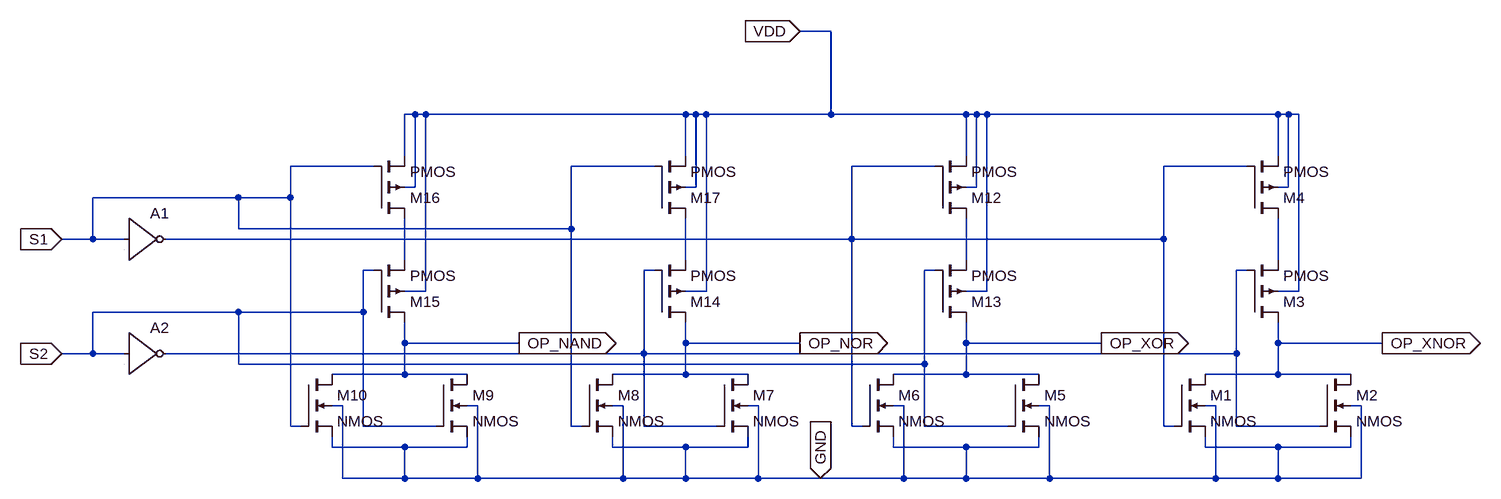
[diagram p0: schematic DEC_2_4.asc]
DEC_2_4.asc, the LTspice schematic file:
Version 4
SHEET 1 880 680
WIRE -416 -320 -464 -320
WIRE -1056 -192 -1072 -192
WIRE -1040 -192 -1056 -192
WIRE -640 -192 -1040 -192
WIRE -624 -192 -640 -192
WIRE -608 -192 -624 -192
WIRE -416 -192 -416 -320
WIRE -416 -192 -608 -192
WIRE -208 -192 -416 -192
WIRE -192 -192 -208 -192
WIRE -176 -192 -192 -192
WIRE 272 -192 -176 -192
WIRE 288 -192 272 -192
WIRE 304 -192 288 -192
WIRE -1072 -128 -1072 -192
WIRE -640 -128 -640 -192
WIRE -208 -128 -208 -192
WIRE 272 -128 272 -192
WIRE -1120 -112 -1248 -112
WIRE -688 -112 -816 -112
WIRE -256 -112 -384 -112
WIRE 224 -112 96 -112
WIRE -1056 -80 -1056 -192
WIRE -1056 -80 -1072 -80
WIRE -624 -80 -624 -192
WIRE -624 -80 -640 -80
WIRE -192 -80 -192 -192
WIRE -192 -80 -208 -80
WIRE 288 -80 288 -192
WIRE 288 -80 272 -80
WIRE -1328 -64 -1552 -64
WIRE -1248 -64 -1248 -112
WIRE -1248 -64 -1328 -64
WIRE -1328 -16 -1328 -64
WIRE -816 -16 -816 -112
WIRE -816 -16 -1328 -16
WIRE -1552 0 -1552 -64
WIRE -1552 0 -1600 0
WIRE -1504 0 -1552 0
WIRE -384 0 -384 -112
WIRE -384 0 -1440 0
WIRE 96 0 96 -112
WIRE 96 0 -384 0
WIRE -1072 32 -1072 -32
WIRE -640 32 -640 -32
WIRE -208 32 -208 -32
WIRE 272 32 272 -32
WIRE -1120 48 -1136 48
WIRE -688 48 -704 48
WIRE -256 48 -272 48
WIRE 224 48 208 48
WIRE -1040 80 -1040 -192
WIRE -1040 80 -1072 80
WIRE -608 80 -608 -192
WIRE -608 80 -640 80
WIRE -176 80 -176 -192
WIRE -176 80 -208 80
WIRE 304 80 304 -192
WIRE 304 80 272 80
WIRE -1328 112 -1552 112
WIRE -1136 112 -1136 48
WIRE -1136 112 -1328 112
WIRE -1072 160 -1072 128
WIRE -896 160 -1072 160
WIRE -640 160 -640 128
WIRE -464 160 -640 160
WIRE -208 160 -208 128
WIRE 0 160 -208 160
WIRE 272 160 272 128
WIRE 432 160 272 160
WIRE -1552 176 -1552 112
WIRE -1552 176 -1600 176
WIRE -1504 176 -1552 176
WIRE -704 176 -704 48
WIRE -704 176 -1440 176
WIRE 208 176 208 48
WIRE 208 176 -704 176
WIRE -1328 192 -1328 112
WIRE -272 192 -272 48
WIRE -272 192 -1328 192
WIRE -1072 208 -1072 160
WIRE -1072 208 -1184 208
WIRE -976 208 -1072 208
WIRE -640 208 -640 160
WIRE -640 208 -752 208
WIRE -544 208 -640 208
WIRE -208 208 -208 160
WIRE -208 208 -320 208
WIRE -96 208 -208 208
WIRE 272 208 272 160
WIRE 272 208 160 208
WIRE 384 208 272 208
WIRE -1168 256 -1184 256
WIRE -960 256 -976 256
WIRE -736 256 -752 256
WIRE -528 256 -544 256
WIRE -304 256 -320 256
WIRE -80 256 -96 256
WIRE 176 256 160 256
WIRE 400 256 384 256
WIRE -1248 288 -1248 -64
WIRE -1232 288 -1248 288
WIRE -1136 288 -1136 112
WIRE -1024 288 -1136 288
WIRE -816 288 -816 -16
WIRE -800 288 -816 288
WIRE -704 288 -704 176
WIRE -592 288 -704 288
WIRE -384 288 -384 0
WIRE -368 288 -384 288
WIRE -272 288 -272 192
WIRE -144 288 -272 288
WIRE 96 288 96 0
WIRE 112 288 96 288
WIRE 208 288 208 176
WIRE 336 288 208 288
WIRE -1184 320 -1184 304
WIRE -1072 320 -1184 320
WIRE -976 320 -976 304
WIRE -976 320 -1072 320
WIRE -752 320 -752 304
WIRE -640 320 -752 320
WIRE -544 320 -544 304
WIRE -544 320 -640 320
WIRE -320 320 -320 304
WIRE -208 320 -320 320
WIRE -96 320 -96 304
WIRE -96 320 -208 320
WIRE 160 320 160 304
WIRE 272 320 160 320
WIRE 384 320 384 304
WIRE 384 320 272 320
WIRE -1168 368 -1168 256
WIRE -1072 368 -1072 320
WIRE -1072 368 -1168 368
WIRE -960 368 -960 256
WIRE -960 368 -1072 368
WIRE -736 368 -736 256
WIRE -736 368 -960 368
WIRE -640 368 -640 320
WIRE -640 368 -736 368
WIRE -528 368 -528 256
WIRE -528 368 -640 368
WIRE -432 368 -528 368
WIRE -304 368 -304 256
WIRE -304 368 -432 368
WIRE -208 368 -208 320
WIRE -208 368 -304 368
WIRE -80 368 -80 256
WIRE -80 368 -208 368
WIRE 176 368 176 256
WIRE 176 368 -80 368
WIRE 272 368 272 320
WIRE 272 368 176 368
WIRE 400 368 400 256
WIRE 400 368 272 368
FLAG -896 160 OP_NAND
IOPIN -896 160 Out
FLAG -464 160 OP_NOR
IOPIN -464 160 Out
FLAG 0 160 OP_XOR
IOPIN 0 160 Out
FLAG 432 160 OP_XNOR
IOPIN 432 160 Out
FLAG -1600 0 S1
IOPIN -1600 0 In
FLAG -1600 176 S2
IOPIN -1600 176 In
FLAG -464 -320 VDD
IOPIN -464 -320 In
FLAG -432 368 GND
IOPIN -432 368 In
SYMBOL nmos4 112 208 R0
SYMATTR InstName M1
SYMBOL nmos4 336 208 R0
SYMATTR InstName M2
SYMBOL pmos4 224 128 M180
SYMATTR InstName M3
SYMBOL pmos4 224 -32 M180
SYMATTR InstName M4
SYMBOL nmos4 -144 208 R0
SYMATTR InstName M5
SYMBOL nmos4 -368 208 R0
SYMATTR InstName M6
SYMBOL nmos4 -592 208 R0
SYMATTR InstName M7
SYMBOL nmos4 -800 208 R0
SYMATTR InstName M8
SYMBOL nmos4 -1024 208 R0
SYMATTR InstName M9
SYMBOL nmos4 -1232 208 R0
SYMATTR InstName M10
SYMBOL pmos4 -256 -32 M180
SYMATTR InstName M12
SYMBOL pmos4 -256 128 M180
SYMATTR InstName M13
SYMBOL pmos4 -688 128 M180
SYMATTR InstName M14
SYMBOL pmos4 -1120 128 M180
SYMATTR InstName M15
SYMBOL pmos4 -1120 -32 M180
SYMATTR InstName M16
SYMBOL pmos4 -688 -32 M180
SYMATTR InstName M17
SYMBOL Digital\\inv -1504 -64 R0
SYMATTR InstName A1
SYMBOL Digital\\inv -1504 112 R0
SYMATTR InstName A2

The netlist it stands for:
* DEC_2_4.asc
M1 OP_XNOR N001 GND GND NMOS
M2 OP_XNOR N006 GND GND NMOS
M3 OP_XNOR N006 N005 VDD PMOS
M4 N005 N001 VDD VDD PMOS
M5 OP_XOR S2 GND GND NMOS
M6 OP_XOR N001 GND GND NMOS
M7 OP_NOR N006 GND GND NMOS
M8 OP_NOR S1 GND GND NMOS
M9 OP_NAND S2 GND GND NMOS
M10 OP_NAND S1 GND GND NMOS
M12 N004 N001 VDD VDD PMOS
M13 OP_XOR S2 N004 VDD PMOS
M14 OP_NOR N006 N003 VDD PMOS
M15 OP_NAND S2 N002 VDD PMOS
M16 N002 S1 VDD VDD PMOS
M17 N003 S1 VDD VDD PMOS
A1 S1 0 0 0 0 N001 0 0 BUF
A2 S2 0 0 0 0 N006 0 0 BUF
.model NMOS NMOS
.model PMOS PMOS
.lib standard.mos
.backanno
.end